# EAGLE design mk6 (EAGLE 9.4.2)
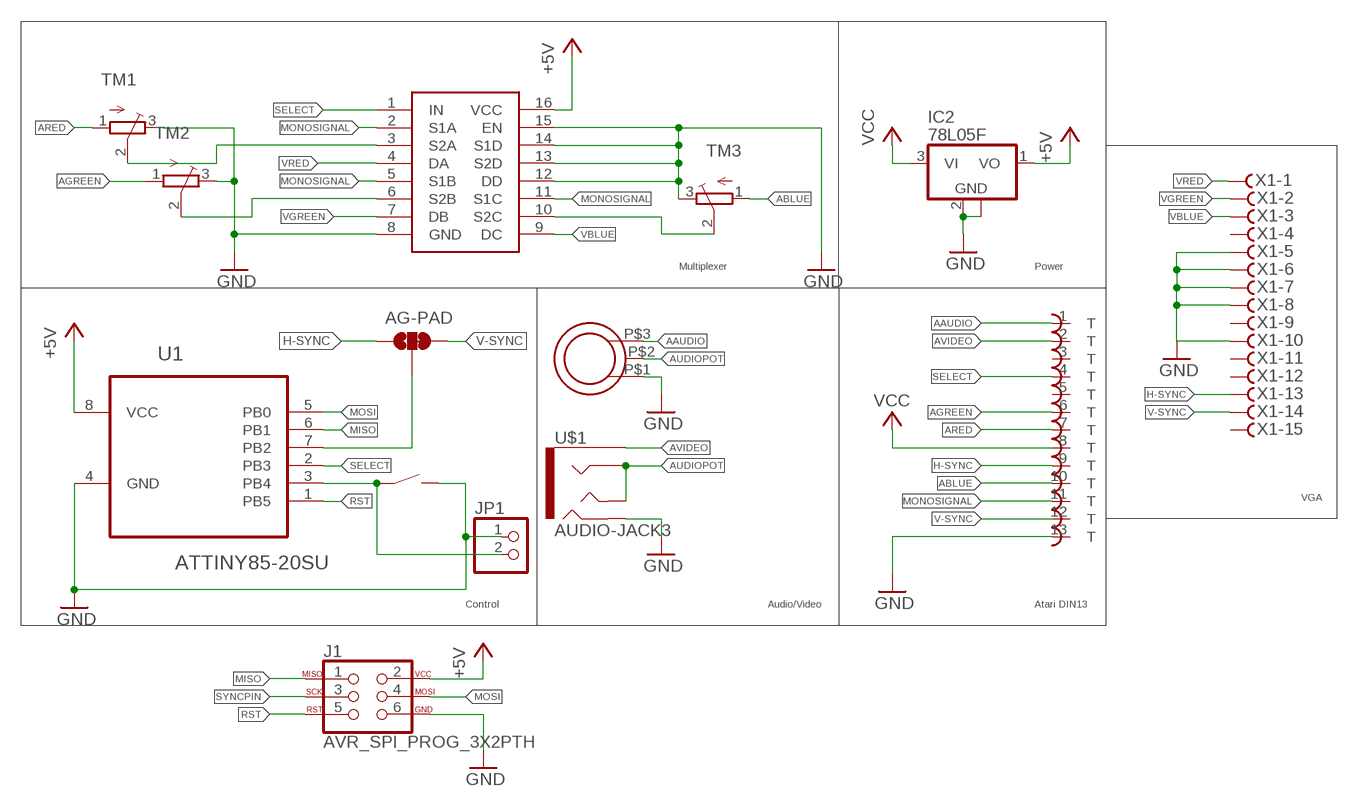
[diagram p0: schematic, sheet 1]

## Parts
AG-PAD  JUMPER-SMT_3_1-NC_TRACE_SILK  [SMT-JUMPER_3_1-NC_TRACE_SILK]
ATARIOUT  DIN13T  [ADADS]
IC2  78L05F  [SOT89]
J1  AVR_SPI_PROG_3X2PTH  [2X3]
JP1  PINHD-1X2  [1X02]
S2  K2-1823SA  [K2-1823SA]
TM1  TRIMPOTTC33X  [TC33X]
TM2  TRIMPOTTC33X  [TC33X]
TM3  TRIMPOTTC33X  [TC33X]
TS5V330  V330  [SOIC16N]
U1  ATTINY85-20SU  [SOIC127P798X216-8N]
U$1  AUDIO-JACK3  [AUDIO-JACK-TRRS-SMD]
U$2  DB-1001N  [THUMB_POT]
X1  F15HDVS  [HDF15V]

## Nets
+5V: IC2.1(VO) J1.2 TS5V330.16(VCC) U1.8(VCC)
AAUDIO: ATARIOUT.1 U$2.P$3
ABLUE: ATARIOUT.10 TM3.1(A)
AGREEN: ATARIOUT.6 TM2.1(A)
ARED: ATARIOUT.7 TM1.1(A)
AUDIOPOT: U$1.RING1 U$1.TIP U$2.P$2
AVIDEO: ATARIOUT.2 U$1.EARTH
GND: ATARIOUT.13 IC2.2(GND) IC2.2@1(GND) J1.6 JP1.1 S2.P$2 TM1.3(E) TM2.3(E) TM3.3(E) TS5V330.8(GND) TS5V330.12(DD) TS5V330.13(S2D) TS5V330.14(S1D) TS5V330.15(EN) U1.4(GND) U$1.RING2 U$2.P$1 X1.5 X1.6 X1.7 X1.8 X1.10
H-SYNC: AG-PAD.1 ATARIOUT.9 X1.13
MISO: J1.1 U1.6(PB1)
MONOSIGNAL: ATARIOUT.11 TS5V330.2(S1A) TS5V330.5(S1B) TS5V330.11(S1C)
MOSI: J1.4 U1.5(PB0)
N$6: JP1.2 S2.P$1 U1.3(PB4)
PBLUE: TM3.2(S) TS5V330.10(S2C)
PGREEN: TM2.2(S) TS5V330.6(S2B)
PRED: TM1.2(S) TS5V330.3(S2A)
RST: J1.5 U1.1(PB5)
SELECT: ATARIOUT.4 TS5V330.1(IN) U1.2(PB3)
SYNCPIN: AG-PAD.2 J1.3 U1.7(PB2)
V-SYNC: AG-PAD.3 ATARIOUT.12 X1.14
VBLUE: TS5V330.9(DC) X1.3
VCC: ATARIOUT.8 IC2.3(VI)
VGREEN: TS5V330.7(DB) X1.2
VRED: TS5V330.4(DA) X1.1
Unconnected: ATARIOUT.3 ATARIOUT.5 X1.4 X1.9 X1.11 X1.12 X1.15

## Notes on the sheet
- Multiplexer | Power
- VGA
- Control | Audio/Video | Atari DIN13

## Library data of the parts
AG-PAD = SparkFun-Jumpers:JUMPER-SMT_3_1-NC_TRACE: Normally closed trace jumper (1 of 2 connections) This jumper has a trace between two pads so it's normally closed (NC). The other connection is normally open (NO). Use a razor knife to open the connection. For best results follow the IPC guidelines for cutting traces: Cutout at least 0.063 mm (0.005 in). Remove all loose material to clean up the cut area. Seal the cut with an approved epoxy. Reapply solder to reclose the connection, or to close the NO connection.
ATARIOUT = ube:DIN13
IC2 = linear:78L*: POSITOIV-VOLTAGE REGULATORS Output up to 100 mA Source: Datasheet <http://focus.ti.com/lit/ds/symlink/ua78l05.pdf>
J1 = SparkFun-Connectors:AVR_SPI_PROG_3X2: AVR ISP 6 Pin This is the reduced ISP connector for AVR programming. Common on Arduino. This footprint will take up less PCB space and can be used with a 10-pin to 6-pin adapter such as SKU: BOB-08508 **Special note about "TEST_POINT" package. The stop mask is on the top side, so if you want your programming test points to be on the bottom of your board, make sure to place this package on the bottom side of the board. This also ensure that the orientation to program from the bottom side will be correct. SparkFun Products: SparkFun ISP Pogo Adapter <https://www.sparkfun.com/products/11591> - NS Tiny AVR Programmer <https://www.sparkfun.com/products/11801> -PTH
JP1 = pinhead:PINHD-1X2: PIN HEADER
S2 = ube:K2-1823SA
TM1-TM3 = adafruit:TRIMPOT: SMT trimmer potentiometer part number TC33X http://www.ladyada.net/library/eagle
TS5V330 = ube:V330
U1 = Atmel_By_element14_Batch_1-00:ATTINY85-20SU: 8-bit Microcontroller with In-System Programmable Flash; MPN: ATTINY85-20SU; OC_FARNELL: 1455164; OC_NEWARK: 58M3797; PACKAGE: SOIC-8; SUPPLIER: Atmel
U$1 = SparkFun-Connectors:AUDIO-JACK3: Audio jack - 3.5mm TRRS variety - two rings.; PROD_ID: CONN-10676
U$2 = irbanur_rev1:DB-1001N: Multicomp DB-1001N thumbwheel potentiometer Source: DB Datasheet <http://www.debonelectronics.com/sale-7784350-db-1001n-thumbwheel-potentiometer.html> created by: mochini@2017 <https://www.fiverr.com/mochini77>
X1 = con-subd:F15?S: SUB-D; OC_FARNELL: unknown; OC_NEWARK: unknown

## Net classes
0 default: width 0.254 mm

## Board
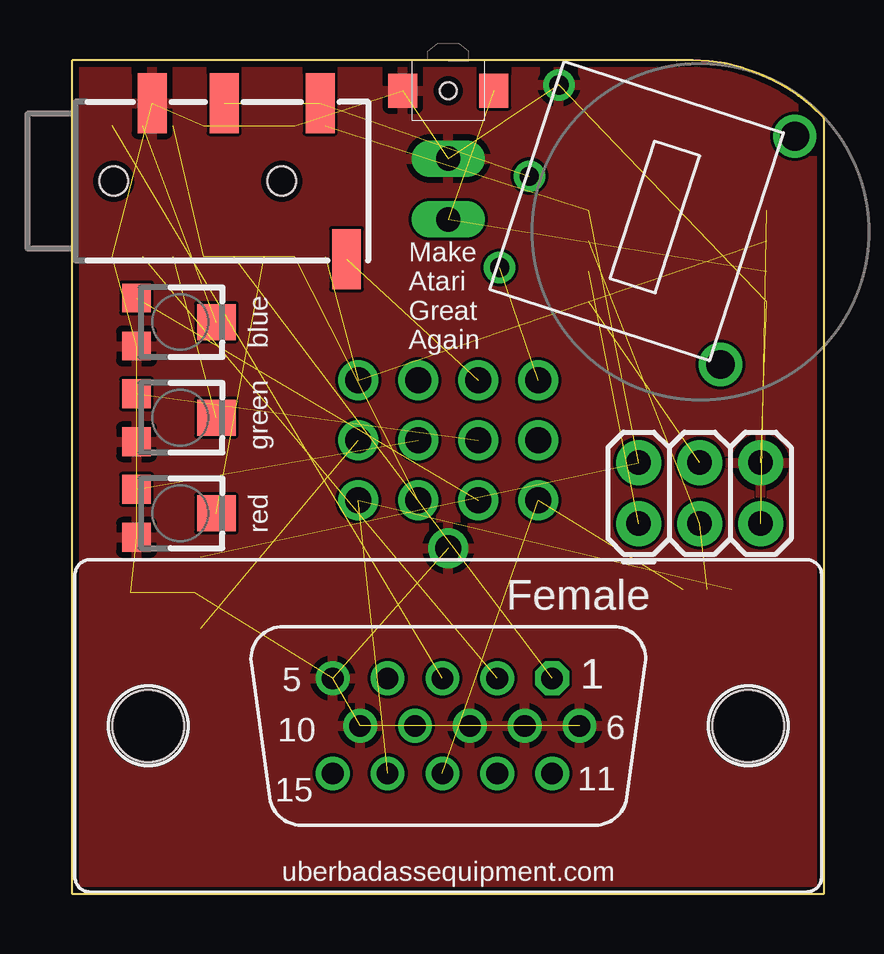
[diagram p1: board, top side]
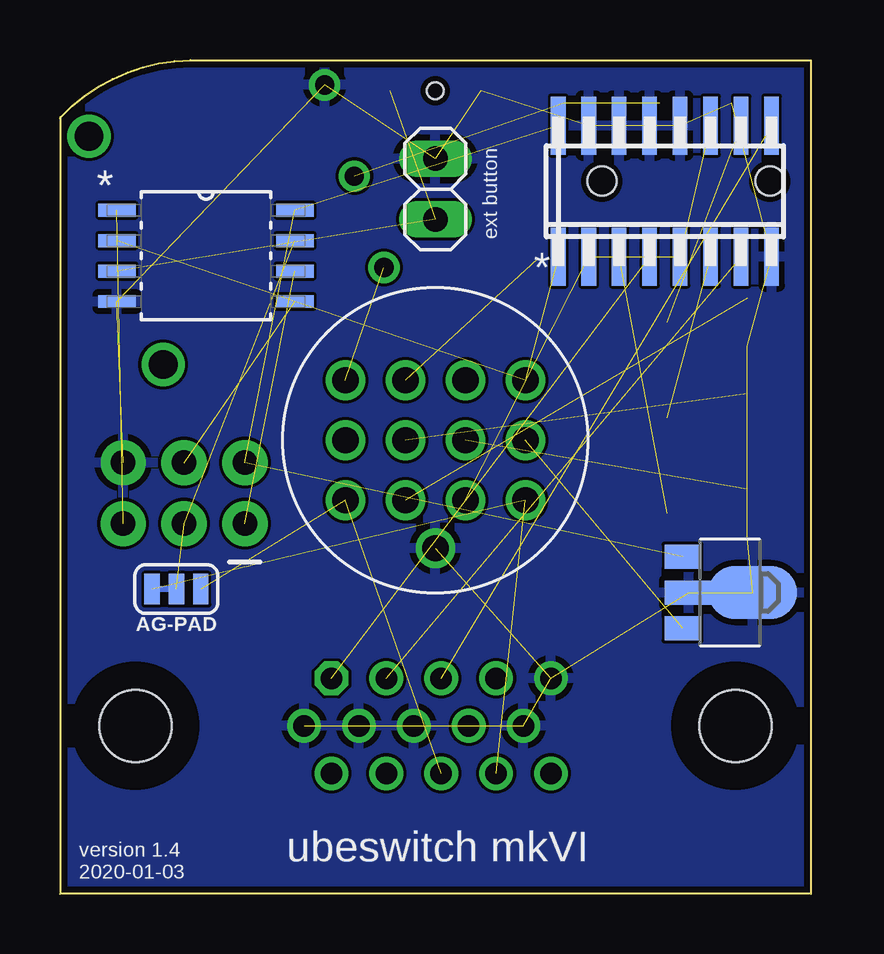
[diagram p2: board, bottom side, seen from below]

Size 31.3 x 34.75 mm. Coordinates in mm from the lower left corner, seen from the top.
Outline: 31.3,32.32 31.3,0 0,0 0,34.73 25.18,34.73 arc-50 31.28,32.37
Copper layers (1*16): Top 0.035mm / dielectric 1.5mm / Bottom 0.035mm
Design rules "dirt_cheap_dirty_boards.v1": minimum track width 5mil, minimum drill 12mil, track to track 5mil, track to pad 5mil, pad to pad 5mil, via to via 5mil, smd to smd 0mil, copper to edge 10mil, drill to drill 10mil, minimum pad ring 10mil, minimum via ring 6mil, stop-mask expansion 2mil, vias tented up to drill 25mil, thermal gap 10mil

### Footprints (pad centres in the part's own frame; a part is rotated, then mirrored left to right if it is on the bottom)
SMT-JUMPER_3_1-NC_TRACE_SILK = smd 0.635 x 1.27: 1 -1.016,0; 2 0,0; 3 1.016,0
ADADS = drill 1.1: 1 -3.75,2.5; 2 -1.25,2.5; 3 1.25,2.5; 4 3.75,2.5; 5 -3.75,0; 6 -1.25,0; 7 1.25,0; 8 3.75,0; 9 -3.75,-2.5; 10 -1.25,-2.5; 11 1.25,-2.5; 12 3.75,-2.5; 13 0,-4.5
SOT89 = smd 1 x 1.5: 1 -1.499,-1.981; 3 1.499,-1.981 | smd 1 x 2: 2 0,-1.727 | smd 2.2 x 3.7: 2@1 0,0.94
2X3 = drill 1.016 pad 1.88: 1 0,0; 2 0,2.54; 3 2.54,0; 4 2.54,2.54; 5 5.08,0; 6 5.08,2.54
1X02 = drill 1.016 long: 1 -1.27,0; 2 1.27,0
K2-1823SA = smd 1.2 x 1.4: P$1 -1.9,0; P$2 1.9,0 | hole 0.7: 0,0
TC33X = smd 1.2 x 1.2: 1 -1,-1.825; 3 1,-1.825 | smd 1.5 x 1.6: 2 0,1.5
SOIC16N = smd 0.61 x 2.413: 1 -4.445,-2.727; 2 -3.175,-2.727; 3 -1.905,-2.727; 4 -0.635,-2.727; 5 0.635,-2.727; 6 1.905,-2.727; 7 3.175,-2.727; 8 4.445,-2.727; 9 4.445,2.727; 10 3.175,2.727; 11 1.905,2.727; 12 0.635,2.727; 13 -0.635,2.727; 14 -1.905,2.727; 15 -3.175,2.727; 16 -4.445,2.727
SOIC127P798X216-8N = smd 1.549 x 0.533: 1 -3.708,1.905; 2 -3.708,0.635; 3 -3.708,-0.635; 4 -3.708,-1.905; 5 3.708,-1.905; 6 3.708,-0.635; 7 3.708,0.635; 8 3.708,1.905
AUDIO-JACK-TRRS-SMD = smd 1.2 x 2.5: EARTH 11.3,-3.25; RING1 6.2,3.25; RING2 3.2,3.25; TIP 10.2,3.25 | hole 1.2: 1.6,0; 8.6,0
THUMB_POT = drill 0.8: P$1 -4,-7.5; P$2 0,-7.5; P$3 4,-7.5 | drill 1.2: P$4 -5,2.5; P$5 5,2.5
HDF15V = drill 0.9 octagon: 1 4.329,1.98 | drill 0.9: 2 2.043,1.98; 3 -0.243,1.98; 4 -2.529,1.98; 5 -4.815,1.98; 6 5.472,0; 7 3.186,0; 8 0.9,0; 9 -1.386,0; 10 -3.672,0; 11 4.329,-1.98; 12 2.043,-1.98; 13 -0.243,-1.98; 14 -2.529,-1.98; 15 -4.815,-1.98 | hole 3: -12.5,0; 12.5,0

### Placement (x,y rotation side)
AG-PAD  26.45,12.7 180 bottom
ATARIOUT  15.66,18.9 0 bottom
IC2  3.37,12.56 270 bottom
J1  23.59,15.43 0 top
JP1  15.66,29.37 270 bottom
S2  15.66,33.46 180 top
TM1  4.5,15.86 270 top
TM2  4.5,19.84 270 top
TM3  4.5,23.83 270 top
TS5V330  6.1,29.28 0 bottom
U1  25.22,26.58 0 bottom
U$1  0.12,29.7 0 top
U$2  26.17,27.58 252 top
X1  15.66,7 0 top

### Tracks (layer width: path | path; a pad name or v marks a point on that pad's centre or on a via)
+5V  (3 unrouted)
AAUDIO  (1 unrouted)
ABLUE  (1 unrouted)
AGREEN  (1 unrouted)
ARED  (1 unrouted)
AUDIOPOT  (2 unrouted)
AVIDEO  (1 unrouted)
GND  (21 unrouted)
  pour Top: -0.22,34.73 31.3,34.73 31.3,0 -0.22,0
  pour Bottom: -0.22,34.73 31.3,34.73 31.3,0 -0.22,0
H-SYNC  (2 unrouted)
MISO  (1 unrouted)
MONOSIGNAL  (3 unrouted)
MOSI  (1 unrouted)
N$6  (2 unrouted)
PBLUE  (1 unrouted)
PGREEN  (1 unrouted)
PRED  (1 unrouted)
RST  (1 unrouted)
SELECT  (2 unrouted)
SYNCPIN  (2 unrouted)
V-SYNC  (2 unrouted)
VBLUE  (1 unrouted)
VCC  (1 unrouted)
VGREEN  (1 unrouted)
VRED  (1 unrouted)

### Text on the board
tPlace: Make / Atari / Great / Again | blue | green | red | uberbadassequipment.com
bPlace: ext button | version 1.4 / 2020-01-03
bNames: ubeswitch mkVI